# EAGLE schematic GloTime (EAGLE 9.6.2)
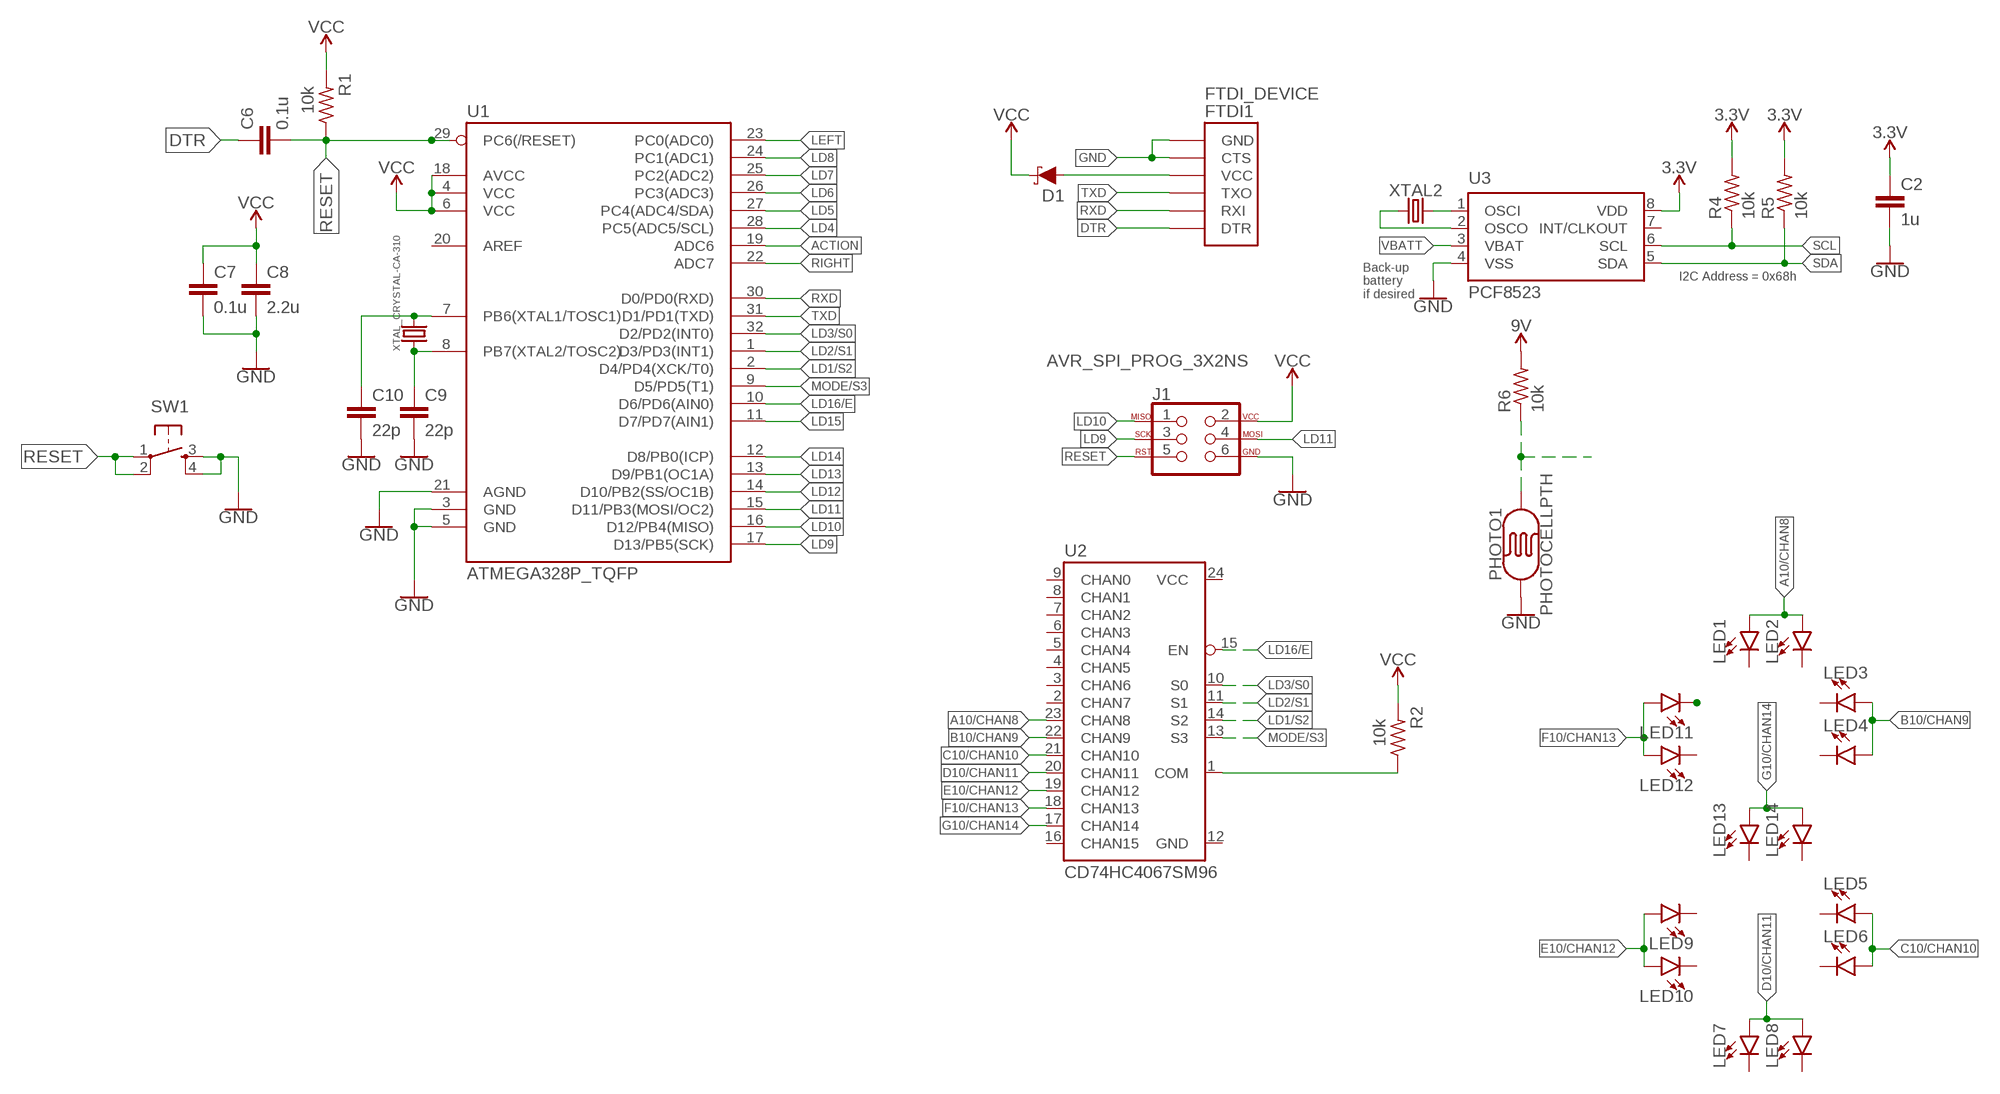
[diagram p0: schematic, sheet 1, part 1 of 2]
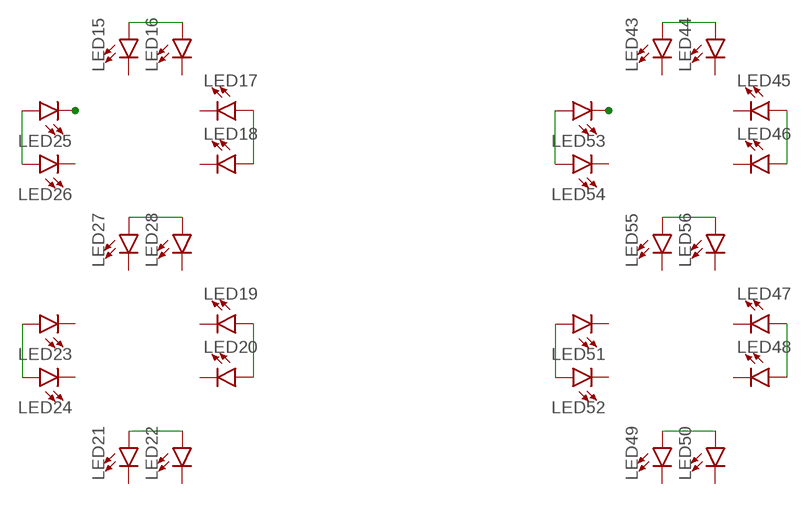
[diagram p1: schematic, sheet 1, part 2 of 2]

## Parts
C2  1u  CAPACITOR0603  [C0603]
C6  0.1u  CAPACITOR0603  [C0603]
C7  0.1u  CAPACITOR0603  [C0603]
C8  2.2u  CAPACITOR0603  [C0603]
C9  22p  CAPACITOR0603  [C0603]
C10  22p  CAPACITOR0603  [C0603]
D1  SCHOTTKY-USC  [USC]
FTDI1  FTDI_DEVICE  [FTDI_DEVICE]
J1  AVR_SPI_PROG_3X2NS  [2X3-NS]
LED1  LED0603  [LED-0603]
LED2  LED0603  [LED-0603]
LED3  LED0603  [LED-0603]
LED4  LED0603  [LED-0603]
LED5  LED0603  [LED-0603]
LED6  LED0603  [LED-0603]
LED7  LED0603  [LED-0603]
LED8  LED0603  [LED-0603]
LED9  LED0603  [LED-0603]
LED10  LED0603  [LED-0603]
LED11  LED0603  [LED-0603]
LED12  LED0603  [LED-0603]
LED13  LED0603  [LED-0603]
LED14  LED0603  [LED-0603]
LED15  LED0603  [LED-0603]
LED16  LED0603  [LED-0603]
LED17  LED0603  [LED-0603]
LED18  LED0603  [LED-0603]
LED19  LED0603  [LED-0603]
LED20  LED0603  [LED-0603]
LED21  LED0603  [LED-0603]
LED22  LED0603  [LED-0603]
LED23  LED0603  [LED-0603]
LED24  LED0603  [LED-0603]
LED25  LED0603  [LED-0603]
LED26  LED0603  [LED-0603]
LED27  LED0603  [LED-0603]
LED28  LED0603  [LED-0603]
LED43  LED0603  [LED-0603]
LED44  LED0603  [LED-0603]
LED45  LED0603  [LED-0603]
LED46  LED0603  [LED-0603]
LED47  LED0603  [LED-0603]
LED48  LED0603  [LED-0603]
LED49  LED0603  [LED-0603]
LED50  LED0603  [LED-0603]
LED51  LED0603  [LED-0603]
LED52  LED0603  [LED-0603]
LED53  LED0603  [LED-0603]
LED54  LED0603  [LED-0603]
LED55  LED0603  [LED-0603]
LED56  LED0603  [LED-0603]
PHOTO1  PHOTOCELLPTH  [PHOTOCELL]
R1  10k  RESISTOR0603  [R0603]
R2  10k  RESISTOR0603  [R0603]
R4  10k  RESISTOR0603  [R0603]
R5  10k  RESISTOR0603  [R0603]
R6  10k  RESISTOR0603  [R0603]
SW1  SPST-PTS830GG140  [BUTTON-GULLWING]
U1  ATMEGA328P_TQFP  [TQFP32-08]
U2  CD74HC4067SM96  74HC4067SM96  [SSOP24]
U3  PCF8523  [SO8]
XTAL2  32.7680kHz  CRYSTALECS-.327-12.5-12-C-TR  [2-SMD.NOLEAD.2.0MMTO1.2MM]
XTAL_CRYSTAL-CA-310  CRYSTAL-CA-310  [CA-301]

## Nets
3.3V: C2.1 R4.2 R5.2 U3.8(VDD)
9V: R6.2
A10/CHAN8: LED1.A LED2.A U2.23(CHAN8)
ACTION: U1.19(ADC6)
B10/CHAN9: LED3.A LED4.A U2.22(CHAN9)
C10/CHAN10: LED5.A LED6.A U2.21(CHAN10)
D10/CHAN11: LED7.A LED8.A U2.20(CHAN11)
DTR: C6.1 FTDI1.DTR
E10/CHAN12: LED9.A LED10.A U2.19(CHAN12)
F10/CHAN13: LED11.A LED11.C LED12.A U2.18(CHAN13)
G10/CHAN14: LED13.A LED14.A U2.17(CHAN14)
GND: C2.2 C7.2 C8.2 C9.2 C10.2 FTDI1.CTS FTDI1.GND J1.6 PHOTO1.1 SW1.3 SW1.4 U1.3(GND) U1.5(GND) U1.21(AGND) U3.4(VSS)
LD1/S2: U1.2(D4/PD4(XCK/T0)) U2.14(S2)
LD2/S1: U1.1(D3/PD3(INT1)) U2.11(S1)
LD3/S0: U1.32(D2/PD2(INT0)) U2.10(S0)
LD4: U1.28(PC5(ADC5/SCL))
LD5: U1.27(PC4(ADC4/SDA))
LD6: U1.26(PC3(ADC3))
LD7: U1.25(PC2(ADC2))
LD8: U1.24(PC1(ADC1))
LD9: J1.3 U1.17(D13/PB5(SCK))
LD10: J1.1 U1.16(D12/PB4(MISO))
LD11: J1.4 U1.15(D11/PB3(MOSI/OC2))
LD12: U1.14(D10/PB2(SS/OC1B))
LD13: U1.13(D9/PB1(OC1A))
LD14: U1.12(D8/PB0(ICP))
LD15: U1.11(D7/PD7(AIN1))
LD16/E: PHOTO1.2 R6.1 U1.10(D6/PD6(AIN0)) U2.15(EN)
LEFT: U1.23(PC0(ADC0))
MODE/S3: U1.9(D5/PD5(T1)) U2.13(S3)
N$1: C10.1 U1.7(PB6(XTAL1/TOSC1)) XTAL_CRYSTAL-CA-310.2
N$2: C9.1 U1.8(PB7(XTAL2/TOSC2)) XTAL_CRYSTAL-CA-310.1
N$3: U3.2(OSCO) XTAL2.P$1
N$4: U3.1(OSCI) XTAL2.P$2
N$5: C7.1 C8.1 ; supply symbol labelled VCC
N$6: D1.+(A) FTDI1.VCC
N$7: R2.1 U2.1(COM)
N$15: LED25.A LED25.C LED26.A
N$16: LED15.A LED16.A
N$17: LED17.A LED18.A
N$18: LED19.A LED20.A
N$19: LED27.A LED28.A
N$20: LED23.A LED24.A
N$21: LED21.A LED22.A
N$29: LED53.A LED53.C LED54.A
N$30: LED43.A LED44.A
N$31: LED45.A LED46.A
N$32: LED47.A LED48.A
N$33: LED55.A LED56.A
N$34: LED51.A LED52.A
N$35: LED49.A LED50.A
RESET: C6.2 J1.5 R1.1 SW1.1 SW1.2 U1.29(PC6(/RESET))
RIGHT: U1.22(ADC7)
RXD: FTDI1.TXO(RXI) U1.30(D0/PD0(RXD))
SCL: R4.1 U3.6(SCL)
SDA: R5.1 U3.5(SDA)
TXD: FTDI1.RXI(TXO) U1.31(D1/PD1(TXD))
VBATT: U3.3(VBAT)
VCC: D1.-(C) J1.2 R1.2 R2.2 U1.4(VCC) U1.6(VCC) U1.18(AVCC)
Unconnected: LED1.C LED2.C LED3.C LED4.C LED5.C LED6.C LED7.C LED8.C LED9.C LED10.C LED12.C LED13.C LED14.C LED15.C LED16.C LED17.C LED18.C LED19.C LED20.C LED21.C LED22.C LED23.C LED24.C LED26.C LED27.C LED28.C LED43.C LED44.C LED45.C LED46.C LED47.C LED48.C LED49.C LED50.C LED51.C LED52.C LED54.C LED55.C LED56.C U1.20(AREF) U2.2(CHAN7) U2.3(CHAN6) U2.4(CHAN5) U2.5(CHAN4) U2.6(CHAN3) U2.7(CHAN2) U2.8(CHAN1) U2.9(CHAN0) U2.12(GND) U2.16(CHAN15) U2.24(VCC) U3.7(INT/CLKOUT)

## Notes on the sheet
- I2C Address = 0x68h
- Back-up
  battery
  if desired

## Library data of the parts
C2 C6-C10 = LinnesLab-Passives:CAPACITOR
D1 = LinnesLab-DiscreteSemi:SCHOTTKY: Schottky diode A Schottky diode is a semiconductor diode which has a low forward voltage drop and a very fast switching action. Example: Digi-Key Part Number: RB161MM-20CT-ND
FTDI1 = LinnesLab-Connectors:FTDI_DEVICE
J1 = LinnesLab-Connectors:AVR_SPI_PROG_3X2: AVR ISP 6 Pin This is the reduced ISP connector for AVR programming. Common on Arduino. This footprint will take up less PCB space and can be used with a 10-pin to 6-pin adapter such as SKU: BOB-08508 **Special note about "TEST_POINT" package. The stop mask is on the top side, so if you want your programming test points to be on the bottom of your board, make sure to place this package on the bottom side of the board. This also ensure that the orientation to program from the bottom side will be correct. SparkFun Products: SparkFun ISP Pogo Adapter <https://www.sparkfun.com/products/11591> - NS Tiny AVR Programmer <https://www.sparkfun.com/products/11801> -PTH
LED1-LED28 LED43-LED56 = LinnesLab-LED:LED: LED (Generic) Standard schematic elements and footprints for 5mm, 3mm, 1206, and 0603 sized LEDs. Generic LEDs with no color specified. LTST-C190KGKT: arrow indicates cathode
PHOTO1 = LinnesLab-Sensors:PHOTOCELL: Photocell (Photodetector, Photo Resistor, CdS) This is a very small light sensor. A photocell changes (also called a photodetector, photo resistor, CdS or photoconductive cell) resistance depending on the amount of light it is exposed to. These little sensors make great ambient light triggers (when light in the room turns on, do something). Datasheet <http://cdn.sparkfun.com/datasheets/Sensors/LightImaging/SEN-09088.pdf> SparkFun Products Mini Photocell <https://www.sparkfun.com/products/9088> (SEN-09088); PROD_ID: COMP-09129; SF_ID: SEN-09088
R1 R2 R4-R6 = LinnesLab-Passives:RESISTOR
SW1 = LinnesLab-Switches:SPST-PTS830GG140
U1 = LinnesLab-Microcontrollers:ATMEGA328P_TQFP: Popular 328P in QFP Storefront component: ATmega328 - TQFP <https://www.sparkfun.com/products/13448> (COM-13448) Datasheet <http://www.sparkfun.com/datasheets/Components/SMD/ATMega328.pdf> SparkFun Products SparkFun RedBoard - Programmed with Arduino <https://www.sparkfun.com/products/12757> (DEV-12757) Arduino Pro Mini 328 - 5V/16MHz <https://www.sparkfun.com/products/11113> (DEV-11113) Arduino Pro Mini 328 - 3.3V/8MHz <https://www.sparkfun.com/products/11114> (DEV-11114) SparkFun OpenLog <https://www.sparkfun.com/products/13712> (DEV-13712) SparkFun MicroView - OLED Arduino Module <https://www.sparkfun.com/products/12923> (DEV-12923) SparkFun Digital Sandbox <https://www.sparkfun.com/products/12651> (DEV-12651) SparkFun PicoBoard <https://www.sparkfun.com/products/11888> (WIG-11888) Arduino Fio <https://www.sparkfun.com/products/10116> (DEV-10116) LilyPad Arduino 328 Main Board <https://www.sparkfun.com/products/13342> (DEV-13342) SparkFun RedStick <https://www.sparkfun.com/products/13741> (DEV-13741) LilyPad MP3 <https://www.sparkfun.com/products/11013> (DEV-11013) LilyPad Arduino SimpleSnap <https://www.sparkfun.com/products/10941> (DEV-10941) SparkFun Stepoko <https://www.sparkfun.com/products/13899> (ROB-13899) SparkFun Geiger Counter <https://www.sparkfun.com/products/11345> (SEN-11345) SparkFun EL Sequencer <https://www.sparkfun.com/products/12781> (COM-12781) Arduino Pro 328 - 5V/16MHz <https://www.sparkfun.com/products/10915> (DEV-10915) CryptoCape <https://www.sparkfun.com/products/12773> (DEV-12773) SparkFun IR Thermometer Evaluation Board - MLX90614 <https://www.sparkfun.com/products/10740> (SEN-10740) SparkFun RedBot Mainboard <https://www.sparkfun.com/products/12097> (ROB-12097) Arduino Pro 328 - 3.3V/8MHz <https://www.sparkfun.com/products/10914> (DEV-10914) SparkFun Block for Intel® Edison - Arduino <https://www.sparkfun.com/products/13036> (DEV-13036) SparkFun Simon Says - Surface Mount Soldering Kit <https://www.sparkfun.com/products/10935> (KIT-10935) SparkFun 7-Segment Serial Display - Red <https://www.sparkfun.com/products/11441> (COM-11441) SparkFun 7-Segment Serial Display - White <https://www.sparkfun.com/products/11629> (COM-11629) SparkFun 7-Segment Serial Display - Yellow <https://www.sparkfun.com/products/11443> (COM-11443) SparkFun 7-Segment Serial Display - Kelly Green <https://www.sparkfun.com/products/11440> (COM-11440) SparkFun 7-Segment Serial Display - Blue <https://www.sparkfun.com/products/11442> (COM-11442) SparkFun OpenSegment Serial Display - 20mm (Blue) <https://www.sparkfun.com/products/11647> (COM-11647) SparkFun OpenSegment Serial Display - 20mm (Green) <https://www.sparkfun.com/products/11646> (COM-11646) SparkFun OpenSegment Serial Display - 20mm (White) <https://www.sparkfun.com/products/11648> (COM-11648) SparkFun OpenSegment Serial Display - 20mm (Red) <https://www.sparkfun.com/products/11644> (COM-11644) SparkFun OpenSegment Serial Display - 20mm (Yellow) <https://www.sparkfun.com/products/11645> (COM-11645) SparkFun OpenSegment Shield <https://www.sparkfun.com/products/13190> (DEV-13190); PROD_ID: IC-09069
U2 = SparkFun-IC-Logic:74*4067: 16-channel analog MUX Datasheet <http://www.sparkfun.com/datasheets/IC/cd74hc4067.pdf> SparkFun Products MP3 Trigger <https://www.sparkfun.com/products/13720> (WIG-13720) SparkFun Analog/Digital MUX Breakout - CD74HC4067 <https://www.sparkfun.com/products/9056> (BOB-09056); PROD_ID: IC-08252
U3 = LinnesLab-Clocks:PCF8523; DIGIKEY: 568-5306-1-ND; I2C_ADDRESS: 0x68h; MFN: PCF8523T/1,118; MFN_MANUFACTURER: NXP USA Inc.
XTAL2 = LinnesLab-Clocks:CRYSTAL; DIGIKEY: XC2288CT-ND; FREQ: 32.7680KHZ; LOAD_CAP: 12.5pF
XTAL_CRYSTAL-CA-310 = LinnesLab-Clocks:CRYSTAL-CA-310